# EAGLE design clock (EAGLE 6.4)
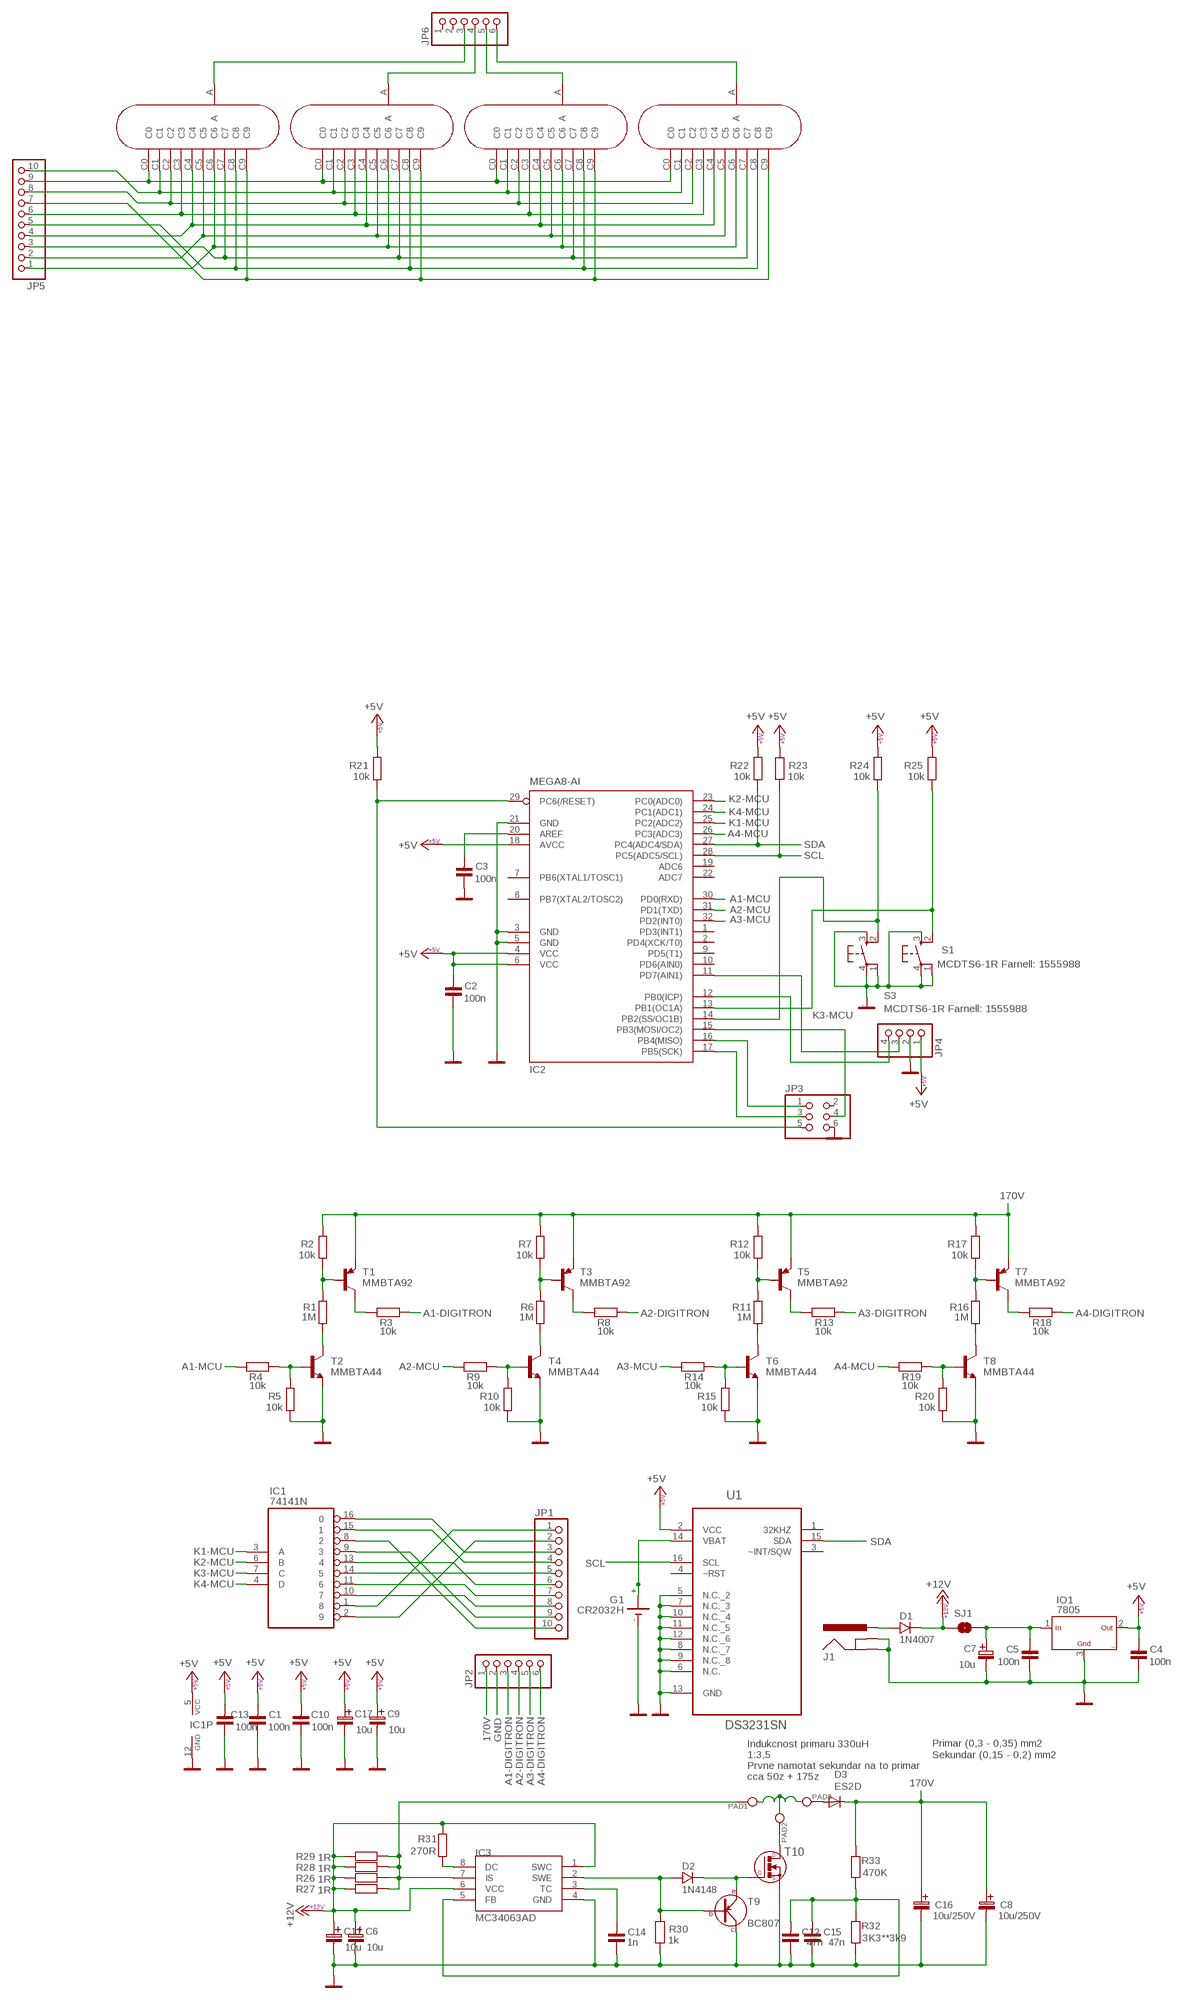
[diagram p0: schematic, sheet 1]

## Parts
C1  100n  C-KERAMIK_SMD_0805  [0805]
C2  100n  C-KERAMIK_SMD_0805  [0805]
C3  100n  C-KERAMIK_SMD_0805  [0805]
C4  100n  C-KERAMIK_SMD_0805  [0805]
C5  100n  C-KERAMIK_SMD_0805  [0805]
C6  10u  10M/16VA  [A]
C7  10u  10M/16VA  [A]
C8  10u/250V  10M/250V  [C_EL_5]
C9  10u  10M/16VA  [A]
C10  100n  C-KERAMIK_SMD_0805  [0805]
C11  10u  10M/16VA  [A]
C12  47n  C-KERAMIK_SMD_0805  [0805]
C13  100n  C-KERAMIK_SMD_0805  [0805]
C14  1n  C-KERAMIK_SMD_0805  [0805]
C15  47n  C-KERAMIK_SMD_0805  [0805]
C16  10u/250V  10M/250V  [C_EL_5]
C17  10u  10M/16VA  [A]
D1  1N4007  1N4007_SM-1  [SM-1]
D2  1N4148  1N4148_SOD80  [SOD-80]
D3  ES2D  [SMB]
E1  Z573M  [Z573M]
E2  Z573M  [Z573M]
E3  Z573M  [Z573M]
E4  Z573M  [Z573M]
G1  CR2032H  [CR2032H]
IC1  74141N  [DIL16]
IC2  MEGA8-AI  [TQFP32-08]
IC3  MC34063AD  [SOIC8]
IO1  7805  78_SMD_SMD  [D2PAK]
J1  SPARKFUN_POWER_JACKSLT  [SPARKFUN_POWER_JACK_SLOT]
JP1  PINHD-1X10  [1X10]
JP2  PINHD-1X6  [1X06]
JP3  PINHD-2X3  [2X03]
JP4  PINHD-1X4  [1X04]
JP5  PINHD-1X10  [1X10]
JP6  PINHD-1X6  [1X06]
PAD1  PAD_1,8  [PAD_1]
PAD2  PAD_1,8  [PAD_1]
PAD3  PAD_1,8  [PAD_1]
R1  1M  R_SMD_0805  [0805]
R2  10k  R_SMD_0805  [0805]
R3  10k  R_SMD_1206  [1206]
R4  10k  R_SMD_0805  [0805]
R5  10k  R_SMD_0805  [0805]
R6  1M  R_SMD_0805  [0805]
R7  10k  R_SMD_0805  [0805]
R8  10k  R_SMD_1206  [1206]
R9  10k  R_SMD_0805  [0805]
R10  10k  R_SMD_0805  [0805]
R11  1M  R_SMD_0805  [0805]
R12  10k  R_SMD_0805  [0805]
R13  10k  R_SMD_1206  [1206]
R14  10k  R_SMD_0805  [0805]
R15  10k  R_SMD_0805  [0805]
R16  1M  R_SMD_0805  [0805]
R17  10k  R_SMD_0805  [0805]
R18  10k  R_SMD_1206  [1206]
R19  10k  R_SMD_0805  [0805]
R20  10k  R_SMD_0805  [0805]
R21  10k  R_SMD_0805  [0805]
R22  10k  R_SMD_0805  [0805]
R23  10k  R_SMD_0805  [0805]
R24  10k  R_SMD_0805  [0805]
R25  10k  R_SMD_0805  [0805]
R26  1R  R_SMD_1206  [1206]
R27  1R  R_SMD_1206  [1206]
R28  1R  R_SMD_1206  [1206]
R29  1R  R_SMD_1206  [1206]
R30  1k  R_SMD_0805  [0805]
R31  270R  R_SMD_0805  [0805]
R32  3K3**3k9  R_SMD_0805  [0805]
R33  470K  R_SMD_0805  [0805]
S1  MCDTS6-1R Farnell: 1555988  31-XX  [B3F-31XX]
S3  MCDTS6-1R Farnell: 1555988  31-XX  [B3F-31XX]
SJ1  SOLDERJUMPERNC  [SJ-NC]
T1  MMBTA92  MMBTA92LT1-PNP-SOT23-BEC  [SOT23-BEC]
T2  MMBTA44  MMBTA42LT1-NPN-SOT23-BEC  [SOT23-BEC]
T3  MMBTA92  MMBTA92LT1-PNP-SOT23-BEC  [SOT23-BEC]
T4  MMBTA44  MMBTA42LT1-NPN-SOT23-BEC  [SOT23-BEC]
T5  MMBTA92  MMBTA92LT1-PNP-SOT23-BEC  [SOT23-BEC]
T6  MMBTA44  MMBTA42LT1-NPN-SOT23-BEC  [SOT23-BEC]
T7  MMBTA92  MMBTA92LT1-PNP-SOT23-BEC  [SOT23-BEC]
T8  MMBTA44  MMBTA42LT1-NPN-SOT23-BEC  [SOT23-BEC]
T9  BC807  [SOT-23]
T10  SMD_NFET  [D2PAK]
U1  DS3231SN  [SOIC127P1032X265-16N]

## Nets
170V: C8.C+(C_EL+) C16.C+(C_EL+) D3.C JP2.1 R2.2 R7.2 R12.2 R17.2 R33.1 T1.E T3.E T5.E T7.E
+5V: C1.2 C2.2 C4.2 C9.+(C_EL+) C10.2 C13.2 C17.+(C_EL+) IC1.5(VCC) IC2.4(VCC) IC2.6(VCC) IC2.18(AVCC) IO1.2(OUT) JP4.1 R21.2 R22.2 R23.2 R24.2 R25.2 U1.2(VCC)
+12V: C6.+(C_EL+) C11.+(C_EL+) D1.K IC3.1(SWC) IC3.6(VCC) R26.1 R27.1 R28.1 R29.1 R31.1 SJ1.1
A1-DIGITRON: JP2.3 R3.1
A1-MCU: IC2.30(PD0(RXD)) R4.2
A2-DIGITRON: JP2.4 R8.1
A2-MCU: IC2.31(PD1(TXD)) R9.2
A3-DIGITRON: JP2.5 R13.1
A3-MCU: IC2.32(PD2(INT0)) R14.2
A4-DIGITRON: JP2.6 R18.1
A4-MCU: IC2.26(PC3(ADC3)) R19.2
GND: C1.1 C2.1 C3.1 C4.1 C5.1 C6.-(C_EL-) C7.-(C_EL-) C8.C-(C_EL-) C9.-(C_EL-) C10.1 C11.-(C_EL-) C12.1 C13.1 C14.1 C15.1 C16.C-(C_EL-) C17.-(C_EL-) G1.- IC1.12(GND) IC2.3(GND) IC2.5(GND) IC2.21(GND) IC3.4(GND) IO1.3(GND) J1.GND@1(GNDBREAK) J1.GND@2(GND) JP2.2 JP3.6 JP4.2 R5.1 R10.1 R15.1 R20.1 R30.1 R32.2 S1.1 S1.3(S) S1.4(P) S3.1 S3.3(S) S3.4(P) T2.E T4.E T6.E T8.E T9.3(C) T10.2(S) U1.5(N.C._2) U1.6(N.C.) U1.7(N.C._3) U1.8(N.C._7) U1.9(N.C._8) U1.10(N.C._4) U1.11(N.C._5) U1.12(N.C._6) U1.13(GND)
K1-MCU: IC1.3(A) IC2.25(PC2(ADC2))
K2-MCU: IC1.6(B) IC2.23(PC0(ADC0))
K3-MCU: IC1.7(C) IC2.15(PB3(MOSI/OC2)) JP3.4
K4-MCU: IC1.4(D) IC2.24(PC1(ADC1))
N$1: R1.2 R2.1 T1.B
N$2: R3.2 T1.C
N$3: R6.2 R7.1 T3.B
N$4: R1.1 T2.C
N$5: R4.1 R5.2 T2.B
N$6: R8.2 T3.C
N$7: R6.1 T4.C
N$8: R9.1 R10.2 T4.B
N$9: R11.2 R12.1 T5.B
N$10: R13.2 T5.C
N$11: R11.1 T6.C
N$12: R14.1 R15.2 T6.B
N$13: R16.2 R17.1 T7.B
N$14: R18.2 T7.C
N$15: R16.1 T8.C
N$16: R19.1 R20.2 T8.B
N$17: IC2.29(PC6(/RESET)) JP3.5 R21.1
N$18: IC2.14(PB2(SS/OC1B)) R24.1 S3.2(S1)
N$19: C3.2 IC2.20(AREF)
N$20: D1.A J1.PWR
N$21: IC2.17(PB5(SCK)) JP3.3
N$24: G1.+ G1.+@1(+) U1.14(VBAT)
N$26: IC2.13(PB1(OC1A)) R25.1 S1.2(S1)
N$27: IC3.7(IS) PAD1.1 R26.2 R27.2 R28.2 R29.2
N$28: C12.2 C15.2 IC3.5(FB) R32.1 R33.2
N$29: PAD2.1 T10.3(D)
N$30: D3.A PAD3.1
N$31: IC1.10 JP1.8
N$32: IC1.9 JP1.9
N$33: IC1.11 JP1.7
N$34: IC1.13 JP1.6
N$35: IC1.8 JP1.10
N$36: IC1.14 JP1.5
N$37: IC1.15 JP1.4
N$38: IC1.16 JP1.3
N$39: IC1.1 JP1.1
N$40: IC1.2 JP1.2
N$41: C14.2 IC3.3(TC)
N$42: D2.A IC3.2(SWE) R30.2 T9.1(B)
N$43: D2.K T9.2(E) T10.1(G)
N$45: IC3.8(DC) R31.2
N$46: IC2.11(PD7(AIN1)) JP4.3
N$47: C5.2 C7.+(C_EL+) IO1.1(IN) SJ1.2
N$53: IC2.12(PB0(ICP)) JP4.4
N$60: E2.A JP6.4
N$61: E1.C0 E2.C0 E3.C0 E4.C0 JP5.9
N$62: E1.C1 E2.C1 E3.C1 E4.C1 JP5.10
N$63: E1.C2 E2.C2 E3.C2 E4.C2 JP5.8
N$64: E1.C3 E2.C3 E3.C3 E4.C3 JP5.6
N$65: E1.C4 E2.C4 E3.C4 E4.C4 JP5.4
N$66: E1.C5 E2.C5 E3.C5 E4.C5 JP5.2
N$67: E1.C6 E2.C6 E3.C6 E4.C6 JP5.1
N$68: E1.C7 E2.C7 E3.C7 E4.C7 JP5.3
N$69: E1.C8 E2.C8 E3.C8 E4.C8 JP5.5
N$70: E1.C9 E2.C9 E3.C9 E4.C9 JP5.7
N$71: E3.A JP6.5
N$72: E4.A JP6.6
N$75: E1.A JP6.3
SCL: IC2.28(PC5(ADC5/SCL)) R23.1 U1.16(SCL)
SDA: IC2.27(PC4(ADC4/SDA)) R22.1 U1.15(SDA)
SDASASDA: IC2.16(PB4(MISO)) JP3.1
Unconnected: IC2.1(PD3(INT1)) IC2.2(PD4(XCK/T0)) IC2.7(PB6(XTAL1/TOSC1)) IC2.8(PB7(XTAL2/TOSC2)) IC2.9(PD5(T1)) IC2.10(PD6(AIN0)) IC2.19(ADC6) IC2.22(ADC7) JP3.2 JP6.1 JP6.2 U1.1(32KHZ) U1.3(~INT/SQW) U1.4(~RST)

## Notes on the sheet
- Indukcnost primaru 330uH
- 1:3,5
- Primar (0,3 - 0,35) mm2
  Sekundar (0,15 - 0,2) mm2
- Prvne namotat sekundar na to primar
- cca 50z + 175z

## Library data of the parts
C1-C5 C10 C12-C15 = #PaJa_22:C-KERAMIK: Kondenzator - keramicky
C6 C7 C9 C11 C17 = #PaJa_C-tantal_SMD:10M/16V
C8 C16 = #PaJa_C-el_2:10M/250V
D1 = #PaJa_22:1N4007: Usmernovaci dioda - 1A, 1000V
D2 = #PaJa_22:1N4148: Univerzalni dioda - 0,15A, 75V
D3 = diode:ES2D: DIODE super fast rectifier, 2 A
E1-E4 = Z573M:Z573M
G1 = battery:CR2032H: LI BATTERY Varta
IC1 = 74xx-eu:74*141: BCD to decimal DECODER/DRIVER
IC2 = atmel:MEGA8: MICROCONTROLLER 8 Kbytes FLASH, 1 kbytes SRAM, 512 bytes EEPROM, USART, 6-channel 10 bit ADC, 2-channel 8 bit ADC Pin compatible with Atmega48, ATMega88, ATMega168 Source: avr.lbr; MPN: ATMEGA8-16AU; OC_FARNELL: 9171371; OC_NEWARK: 73M8863
IC3 = mc34063:MC34063
IO1 = #PaJa_22:78??: Stabilizátor - 1A a 1,5A ?? - napeti => 05, 06, 08, 09, 12, 15, 18, 20, 24 => 1,5A ?? - napeti => 10, 12, 15, 18 => 1A S ?? - napeti => 05, 09, 10, 12, 15, 18, 24 => 2A T ?? - napeti => 05 => 3A
J1 = 74141:SPARKFUN_POWER_JACK: Power Jack This is the standard 5.5mm barrel jack for power. The PTH is the most common, proven, reliable, footprint. All others are experimental. The Slot footprint only works if the mill layer is transmitted to the PCB fab house so be warned. Spark Fun Electronics SKU : PRT-00119. Mating wall wart : TOL-00298 (and others)
JP1 JP5 = pinhead:PINHD-1X10: PIN HEADER
JP2 JP6 = pinhead:PINHD-1X6: PIN HEADER
JP3 = pinhead:PINHD-2X3: PIN HEADER
JP4 = pinhead:PINHD-1X4: PIN HEADER
PAD1-PAD3 = #Jan_01:PAD: Pajeci bod - 1.8 mm prumer
R1 R2 R5-R7 R10-R12 R15-R17 R20-R33 = #PaJa_22:R: Rezistor
R3 R4 R8 R9 R13 R14 R18 R19 = #PaJa_30:R: Rezistor
S1 S3 = switch-omron:31-XX: OMRON SWITCH; MPN: B3F-3100; OC_FARNELL: 959704; OC_NEWARK: 36M3582
SJ1 = SparkFun:SOLDERJUMPER: Solder Jumper Standard SMD solder jumper. Used to automate production. Two varients : Normally Open and Normally Closed are the same, but have different paste layers. NC will have a large amount of paste and should jumper during reflow.
T1 T3 T5 T7 = transistor:*-PNP-: PNP Transistror
T2 T4 T6 T8 = transistor:*-NPN-: NPN Transistror BF959 corrected 2008.03.06
T9 = #PaJa_22:BC807: SMD tranzistor - PNP - ekv. BC327
T10 = #PaJa_22:SMD_NFET
U1 = DS3231:DS3231SN: Extremely Accurate I2C-Integrated RTC/TCXO/Crystal; MPN: DS3231SN#; OC_FARNELL: 1593292; OC_NEWARK: 68K3406; PACKAGE: SOIC-16; SUPPLIER: Maxim

## Board
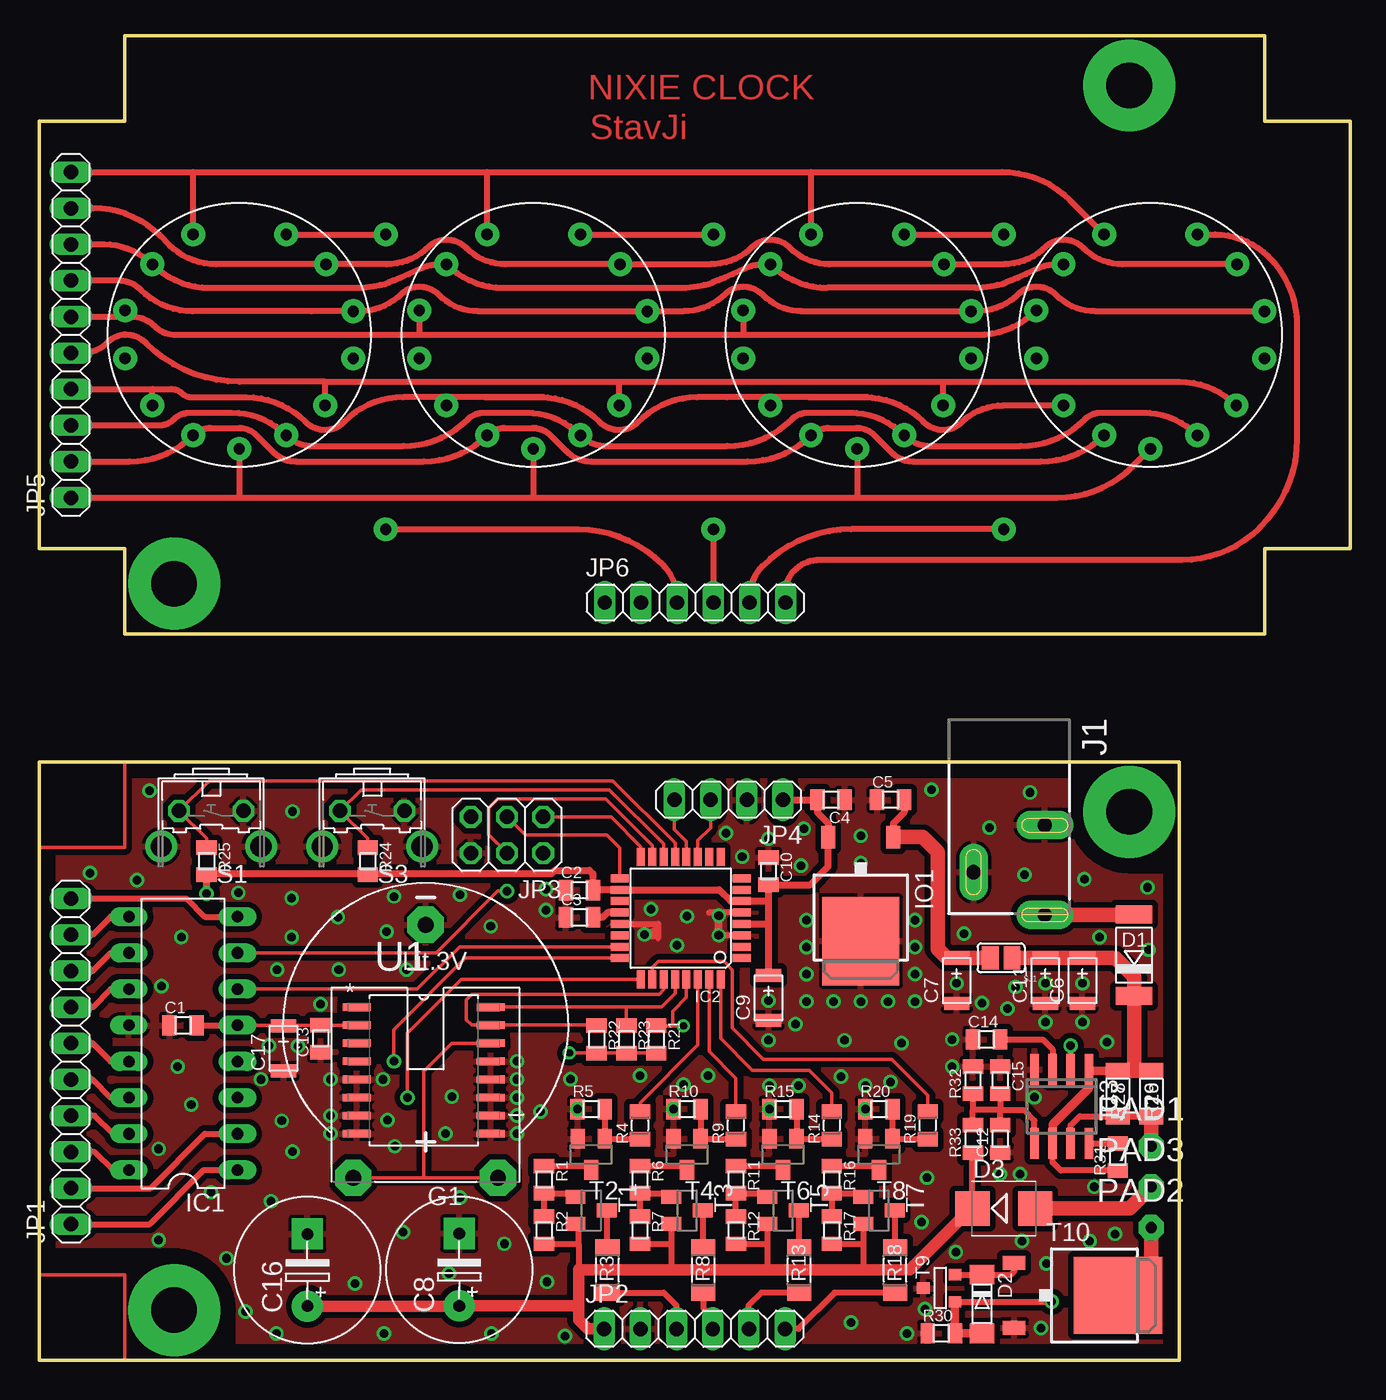
[diagram p1: board, top side]
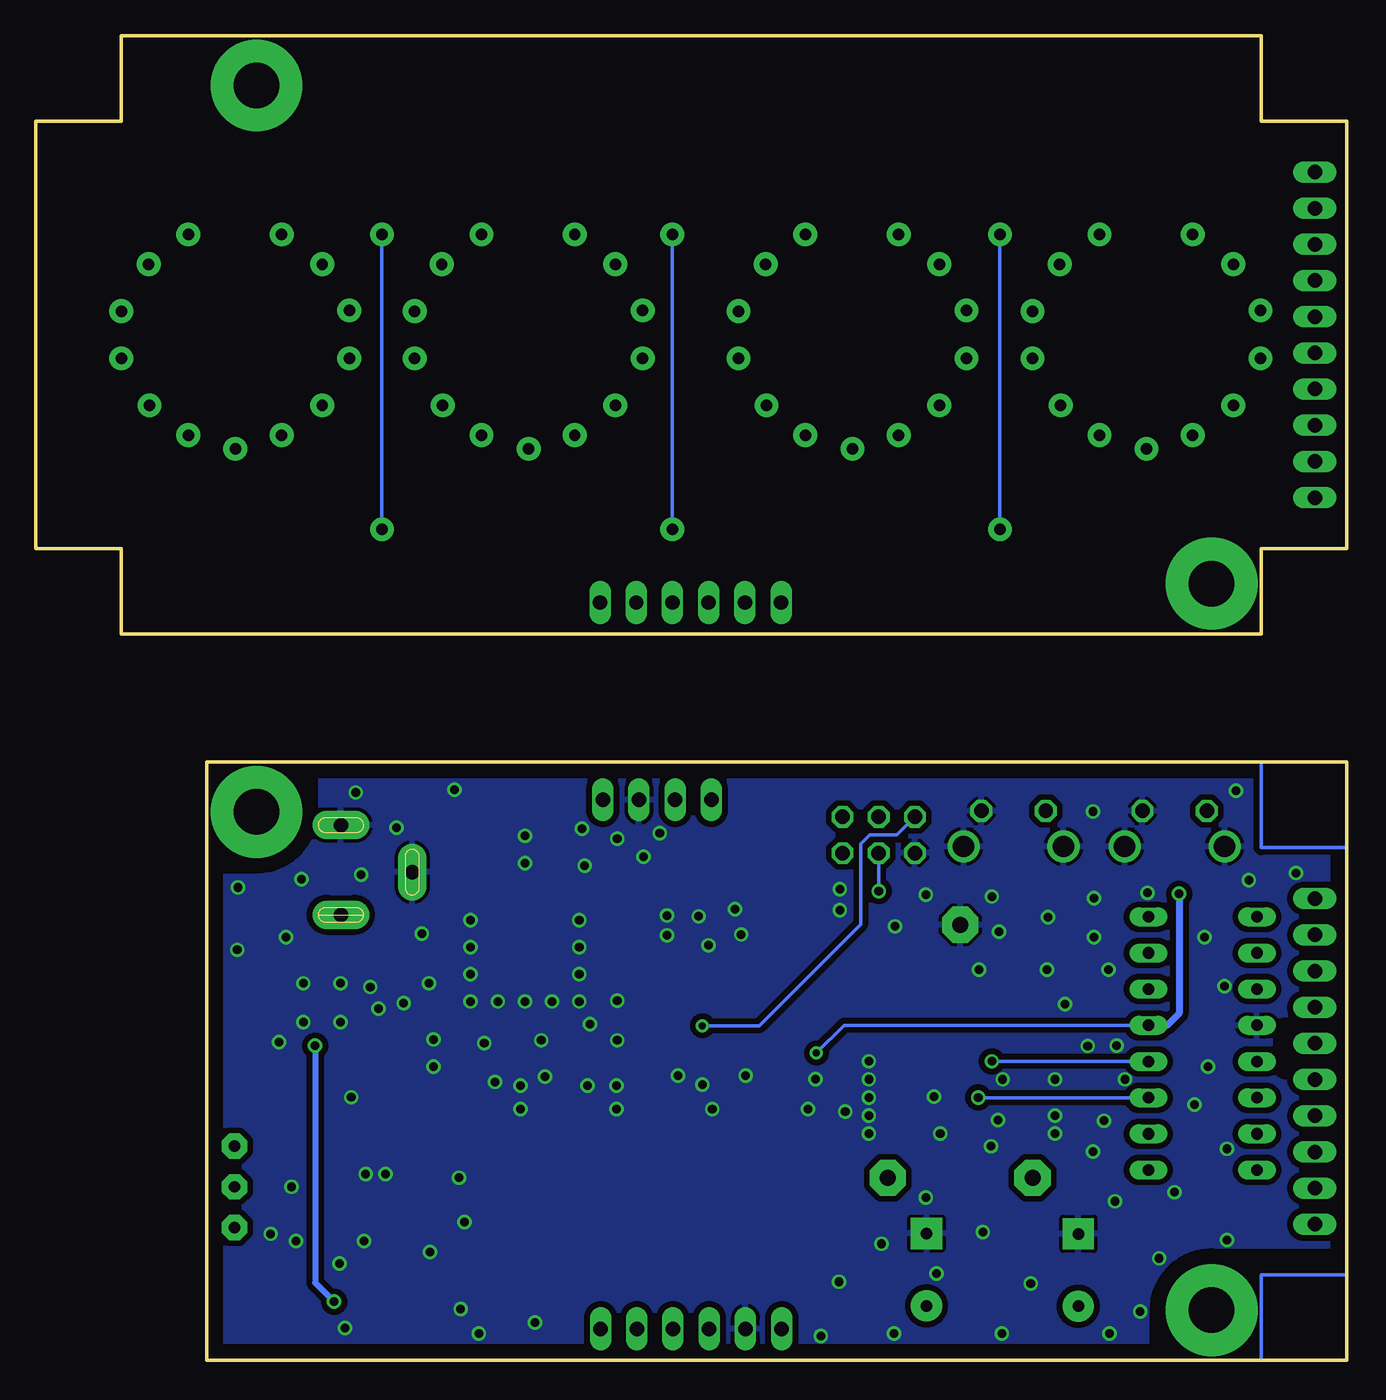
[diagram p2: board, bottom side, seen from below]

Size 92 x 93 mm. Coordinates in mm from the lower left corner, seen from the top.
Outline: 80,33 80,42 0,42 0,0 80,0 80,32.95
Outline: 0,87 0,57 6,57 6,51 86,51 86,57 92,57 92,87 86,87 86,93 6,93 6,87 0,87
Copper layers (1*16): Top 0.035mm / dielectric 1.5mm / Bottom 0.035mm
Design rules "default *": minimum track width 10mil, minimum drill 24mil, track to track 8mil, track to pad 8mil, pad to pad 8mil, via to via 8mil, smd to smd 8mil, copper to edge 40mil, drill to drill 8mil, minimum pad ring 10mil, minimum via ring 8mil, stop-mask expansion 4mil, vias tented up to drill 25mil, thermal gap 10mil
tRestrict: 7 lines
bRestrict: 7 lines

### Footprints (pad centres in the part's own frame; a part is rotated, then mirrored left to right if it is on the bottom)
0805 = smd 1.016 x 1.422: 1 -0.953,0; 2 0.953,0
A = smd 0.914 x 1.778: + 1.587,0; - -1.587,0
C_EL_5 = drill 0.813 pad 2.184: C+ -2.54,0 | drill 0.813 pad 2.184 square: C- 2.54,0
SM-1 = smd 1.27 x 2.54: A 2.857,0; K -2.857,0
SOD-80 = smd 1.397 x 1.702: A 1.905,0; K -2.223,0
SMB = smd 2.4 x 2.4: A 2.2,0; C -2.2,0
Z573M = drill 0.8 pad 1.676: A 3.302,7.048; C0 6.096,4.953; C1 -3.239,7.048; C2 -6.096,4.953; C3 -8.001,1.714; C4 -6.096,-4.953; C5 -3.239,-7.048; C6 0,-8.001; C7 3.302,-7.048; C8 6.032,-4.953; C9 8.001,1.651; NC -8.001,-1.651; PR 8.001,-1.651
CR2032H = drill 1.118 pad 2.54 octagon: + 5.08,10.795; +@1 -5.08,10.795; - 0,-6.985
DIL16 = drill 0.813 long: 1 -8.89,-3.81; 2 -6.35,-3.81; 3 -3.81,-3.81; 4 -1.27,-3.81; 5 1.27,-3.81; 6 3.81,-3.81; 7 6.35,-3.81; 8 8.89,-3.81; 9 8.89,3.81; 10 6.35,3.81; 11 3.81,3.81; 12 1.27,3.81; 13 -1.27,3.81; 14 -3.81,3.81; 15 -6.35,3.81; 16 -8.89,3.81
TQFP32-08 = smd 1.27 x 0.559: 1 -4.293,2.8; 2 -4.293,2; 3 -4.293,1.2; 4 -4.293,0.4; 5 -4.293,-0.4; 6 -4.293,-1.2; 7 -4.293,-2; 8 -4.293,-2.8; 17 4.293,-2.8; 18 4.293,-2; 19 4.293,-1.2; 20 4.293,-0.4; 21 4.293,0.4; 22 4.293,1.2; 23 4.293,2; 24 4.293,2.8 | smd 0.559 x 1.27: 9 -2.8,-4.293; 10 -2,-4.293; 11 -1.2,-4.293; 12 -0.4,-4.293; 13 0.4,-4.293; 14 1.2,-4.293; 15 2,-4.293; 16 2.8,-4.293; 25 2.8,4.293; 26 2,4.293; 27 1.2,4.293; 28 0.4,4.293; 29 -0.4,4.293; 30 -1.2,4.293; 31 -2,4.293; 32 -2.8,4.293
SOIC8 = smd 0.6 x 2.2: 1 -1.905,-2.6; 2 -0.635,-2.6; 3 0.635,-2.6; 4 1.905,-2.6; 5 1.905,2.6; 6 0.635,2.6; 7 -0.635,2.6; 8 -1.905,2.6
D2PAK = smd 1 x 1.6: 1 -2.28,-4.8; 2 2.28,-4.8 | smd 5.4 x 6.2: 3 0,2.5
SPARKFUN_POWER_JACK_SLOT = drill 1 pad 2 long: GND@1 2.58,7.5; GND@2 7.58,10.8; PWR 2.58,13.8
1X10 = drill 1.016 long: 1 -11.43,0; 2 -8.89,0; 3 -6.35,0; 4 -3.81,0; 5 -1.27,0; 6 1.27,0; 7 3.81,0; 8 6.35,0; 9 8.89,0; 10 11.43,0
1X06 = drill 1.016 long: 1 -6.35,0; 2 -3.81,0; 3 -1.27,0; 4 1.27,0; 5 3.81,0; 6 6.35,0
2X03 = drill 1.016 octagon: 1 -2.54,-1.27; 2 -2.54,1.27; 3 0,-1.27; 4 0,1.27; 5 2.54,-1.27; 6 2.54,1.27
1X04 = drill 1.016 long: 1 -3.81,0; 2 -1.27,0; 3 1.27,0; 4 3.81,0
PAD_1 = drill 0.8 pad 1.778 octagon: 1 0,0
1206 = smd 1.143 x 1.702: 1 -1.587,0; 2 1.587,0
B3F-31XX = drill 1.016 octagon: 1 -2.261,-1.245; 2 2.261,-1.245 | drill 1.499 pad 2.159: 3 -3.505,1.245; 4 3.505,1.245
SJ-NC = smd 1.168 x 1.6: 1 -0.762,0; 2 0.762,0
SOT23-BEC = smd 1 x 1.4: B -0.95,-1.1; C 0,1.1; E 0.95,-1.1
SOT-23 = smd 0.787 x 0.889: 1 -0.953,-0.953; 2 0.953,-0.953; 3 0,1.27
SOIC127P1032X265-16N = smd 1.981 x 0.533: 1 -4.699,4.445; 2 -4.699,3.175; 3 -4.699,1.905; 4 -4.699,0.635; 5 -4.699,-0.635; 6 -4.699,-1.905; 7 -4.699,-3.175; 8 -4.699,-4.445; 9 4.699,-4.445; 10 4.699,-3.175; 11 4.699,-1.905; 12 4.699,-0.635; 13 4.699,0.635; 14 4.699,1.905; 15 4.699,3.175; 16 4.699,4.445

### Placement (x,y rotation side)
C1  10.1,23.52 0 top
C2  37.91,33 0 top
C3  37.91,31.1 0 top
C4  55.56,39.35 180 top
C5  59.75,39.35 0 top
C6  73.22,26.65 90 top
C7  64.39,26.65 90 top
C8  29.48,6.36 90 top
C9  51.18,25.45 90 top
C10  51.18,34.34 270 top
C11  70.61,26.65 90 top
C12  67.44,15.54 90 top
C13  19.75,22.59 90 top
C14  66.48,22.53 0 top
C15  67.44,19.67 270 top
C16  18.82,6.33 90 top
C17  17.14,21.89 90 top
D1  76.83,28.43 90 top
D2  66.17,3.79 270 top
D3  67.69,10.65 0 top
E1  14.03,71.99 0 top
E2  34.67,71.99 0 top
E3  57.4,71.99 0 top
E4  77.98,71.99 0 top
G1  27.11,23.59 180 top
IC1  10.1,22.25 90 top
IC2  45.02,31.04 180 top
IC3  71.75,17.83 180 top
IO1  57.66,31.92 180 top
J1  73.15,45.07 180 top
JP1  2.22,20.98 90 top
JP2  46,2.21 0 top
JP3  32.83,36.88 180 top
JP4  48.39,39.35 180 top
JP5  2.22,71.99 90 top
JP6  46.04,53.2 0 top
PAD1  78.04,15.03 0 top
PAD2  78.04,9.32 0 top
PAD3  78.04,12.18 0 top
R1  35.43,12.68 270 top
R2  35.43,9.13 270 top
R3  39.88,6.33 90 top
R4  42.16,16.49 90 top
R5  38.73,17.64 0 top
R6  42.16,12.68 270 top
R7  42.16,9.13 270 top
R8  46.61,6.33 90 top
R9  48.9,16.49 90 top
R10  45.47,17.64 0 top
R11  48.9,12.68 270 top
R12  48.9,9.13 270 top
R13  53.34,6.33 90 top
R14  55.63,16.49 90 top
R15  52.2,17.64 0 top
R16  55.63,12.68 270 top
R17  55.63,9.13 270 top
R18  60.07,6.33 90 top
R19  62.36,16.49 90 top
R20  58.93,17.64 0 top
R21  43.31,22.53 270 top
R22  39.12,22.53 270 top
R23  41.21,22.53 270 top
R24  23.05,35.04 270 top
R25  11.75,35.04 270 top
R26  78.04,18.72 270 top
R27  75.69,18.72 270 top
R28  75.69,18.72 270 top
R29  78.04,18.72 270 top
R30  63.31,1.89 0 top
R31  75.69,14.27 90 top
R32  65.53,19.67 90 top
R33  65.53,15.54 90 top
S1  12.06,37.32 180 top
S3  23.37,37.32 180 top
SJ1  67.5,28.24 180 top
T1  38.73,10.53 270 top
T2  38.73,14.46 180 top
T3  45.47,10.53 270 top
T4  45.47,14.46 180 top
T5  52.2,10.53 270 top
T6  52.2,14.46 180 top
T7  58.93,10.53 270 top
T8  58.93,14.46 180 top
T9  63.31,5.06 90 top
T10  73.22,4.56 270 top
U1  26.99,20.36 0 top

### Tracks (layer width: path | path; a pad name or v marks a point on that pad's centre or on a via)
170V
  Top 0.406: T5.E 51.1,8.18 | 51.1,8.18 51.1,6.38 | 51.1,6.38 51.05,6.34 | T3.E 44.37,8.18 | 44.37,8.18 44.37,6.38 44.32,6.34 | T7.E 57.83,8.18 | 37.85,8.18 37.85,9.57 T1.E | R2.2 37.85,8.18 | 44.32,8.18 44.37,8.18 | R12.2 51.1,8.18 | R17.2 57.83,8.18 | 57.83,8.18 57.83,6.34 | D3.C 65.49,14.55 R33.1 | 37.85,8.18 37.85,6.4 | R7.2 44.32,8.18 | 44.32,8.18 44.32,8.11 | 51.1,6.38 51.1,6.36 51.12,6.34
  Top 0.813: 37.85,6.34 37.85,6.4 | 37.85,6.34 44.32,6.34 51.12,6.34 57.83,6.34 61.09,6.34 65.41,10.65 D3.C | C16.C+ 29.52,3.79 C8.C+ 37.85,3.82 | 37.85,3.82 37.85,6.34 | 37.85,3.82 37.85,2.84 38.48,2.21 JP2.1
+5V  (via drill 0.5, 0.6)
  Top 0.254: R22.2 R23.2 R21.2 R22.2 | R22.2 v37.21,21.57 | IC1.5 17.21,23.52 19.81,23.52 22.28,23.52 U1.2
  Top 0.406: C1.2 IC1.5 | C13.2 19.81,23.54 19.81,23.52 | C17.+ 17.21,23.48 17.21,23.52
  Top 0.508: C9.+ 51.18,30.59 | 51.18,30.59 51.18,32.18 | 51.18,32.18 C10.2 54.1,33.39 55.37,34.66 IO1.2 55.37,36.73 55.37,37.7 54.61,38.47 C4.2 JP4.1 | IC2.4 51.14,30.64 51.18,30.59 | 51.18,32.18 51.12,32.24 IC2.6 48.51,32.24 47.72,33.04 IC2.18 39.05,33.04 C2.2 38.86,34.15 38.61,34.4 36.2,34.4 35.94,34.15 23.05,34.15 | 11.81,34.15 R25.2 | 23.24,34.15 23.3,34.08 R24.2 23.05,34.15 | v11.75,32.75 R25.2 | 23.05,34.15 11.75,34.15 R25.2
  Bottom 0.254: v37.21,21.57 35.27,23.52 IC1.5
  Bottom 0.508: v11.75,32.75 11.75,24.34 12.57,23.52 IC1.5
+12V
  Top 0.406: R31.1 71.69,13.32 71.12,13.89 IC3.6
  Top 0.61: R26.1 77.98,20.3 76.83,20.3 R28.1 75.37,20.3 73.78,20.3 IC3.1 73.66,19.1 71.12,16.56 IC3.6
  Top 1.016: SJ1.1 C11.+ C6.+ 75.5,28.24 76.83,26.91 D1.K 76.83,20.3 | 75.37,20.37 75.37,20.3 77.98,20.3
A1-DIGITRON
  Top 0.406: R3.1 43.81,4.75 44.73,3.83 JP2.3
A1-MCU
  Top 0.254: R4.2 42.16,18.08 46.22,22.14 IC2.30
A2-DIGITRON
  Top 0.406: R8.1 46.61,3.67 47.27,3.01 JP2.4
A2-MCU
  Top 0.254: IC2.31 47.02,21.67 48.9,19.8 R9.2
A3-DIGITRON
  Top 0.406: R13.1 50.67,4.75 49.81,3.88 JP2.5
A3-MCU
  Top 0.254: R14.2 55.63,18.78 54.04,20.37 50.04,20.37 47.82,22.58 IC2.32
A4-DIGITRON
  Top 0.406: R18.1 55.82,4.75 53.28,2.21 JP2.6
A4-MCU
  Top 0.254: R19.2 62.36,18.59 59.82,21.13 50.8,21.13 48.64,23.35 48.64,27.42 48.07,27.99 43.43,27.99 43.02,27.58 IC2.26
GND  (via drill 0.6)
  Top 0.406: IC2.5 46.99,31.44 46.99,31.42 | 47.75,29.84 v47.69,29.83 47.62,29.83 47.62,31.29 47.75,31.29 47.75,29.84 | IC2.3 47.75,29.84 | IC2.21 43.43,30.64 43.43,29.64 | v42.48,29.89 43.18,30.21 43.18,29.77 42.42,29.77 42.42,30.27
  other vias: 57.66,34.91 57.66,25.19 55.75,25.19 59.56,25.19 53.85,29 53.85,27.1 53.85,25.19 61.47,25.19 61.47,29 61.47,27.1 53.85,30.91 61.47,30.91 44.51,17.64 51.24,17.64 57.98,17.64 37.78,17.64 42.93,31.67 67.44,13.07 68.83,13.07 20.45,15.91 20.45,17.18 20.45,19.72 33.53,15.91 33.53,17.18 33.53,18.45 33.53,19.72 33.53,20.99 57.66,36.81 69.85,18.46 64.07,20.62 64.07,22.53 47.69,31.23 35.56,33.07 44.77,29.13 45.47,31.16 56.96,2.65 75.5,8.87 69.15,34.08 62.61,40.05 66.67,37.39 69.53,39.86 28.51,15.91 28.96,18.51 24.96,15.02 24.45,16.86 51.18,36.62 35.56,31.61 49.34,35.35 48.2,37.01 70.29,2.27 60.9,1.89 64.33,7.6 68.96,8.37 70.68,6.78 73.72,8.37 74.04,12.18 61.91,9.7 62.29,12.81 51.18,22.46 53.09,23.61 51.18,25.26 73.22,26.46 70.61,26.46 64.39,26.46 70.61,23.73 73.22,23.73 74.93,22.34 77.85,28.81 74.42,29.7 64.9,29.96 56.52,22.46 60.52,22.27 66.17,25.07 68.52,26.21 67.94,24.69 62.17,3.6 77.79,33.2 73.34,33.77 16.64,1.89 14.48,3.41 22.16,5.38 25.53,9 35.62,5.51 32.64,8.18 36.89,1.7 8.38,8.43 12.06,11.8 13.14,7.16 16.26,11.16 29.53,11.41 17.78,14.65 17.02,16.81 8.38,14.84 10.67,17.95 9.72,20.62 8.57,26.27 9.97,29.7 3.56,34.21 6.86,33.7 7.75,39.99 17.78,38.53 17.72,29.7 17.72,32.43 13.97,32.81 24.38,30.08 20.95,31.1 24.89,32.56 29.53,32.69 31.69,30.46 25.78,27.42 21.02,27.42 16.7,27.42 42.16,19.99 37.27,19.73 35.18,17.45 45.21,19.35 56.26,19.92 57.98,19.29 51.24,19.29 53.28,19.29 46.93,19.99 59.75,19.54 53.47,34.72 53.66,37.32 19.75,25 24.13,19.72 15.56,19.72 18.16,22.07 24.19,1.89 31.75,1.89 28.77,6.08 16.13,22.08
  pour Bottom (isolate 0.406): -1,43 96,43 96,-4 -1,-4
  pour Top (isolate 0.406): -1,43 96,43 96,-4 -1,-4
K1-MCU  (via drill 0.6)
  Top 0.254: v25.84,18.45 25.84,22.96 29.63,26.74 IC2.25
  Bottom 0.254: IC1.3 v25.83,18.44 v25.84,18.45
K2-MCU
  Top 0.254: IC2.23 29.51,29.04 26.53,26.06 IC1.6
K3-MCU  (via drill 0.6)
  Top 0.254: IC2.15 43.02,36.15 39.75,39.42 32.19,39.42 31.56,38.78 31.56,36.88 JP3.4 | IC1.7 27.85,28.6 32.19,32.94 v32.83,32.94
  Bottom 0.254: v32.83,32.94 JP3.4
K4-MCU  (via drill 0.6)
  Top 0.254: v24.89,20.99 24.89,23.21 29.91,28.24 IC2.24
  Bottom 0.254: IC1.4 24.88,20.98 v24.89,20.99
N$1
  Top 0.406: R2.1 R1.2 37.63,11.73 T1.B
N$2
  Top 0.406: T1.C 39.84,7.96 R3.2
N$3
  Top 0.406: R7.1 R6.2 44.37,11.73 T3.B
N$4
  Top 0.406: R1.1 38.73,13.64 T2.C
N$5
  Top 0.406: R5.2 T2.B 42.16,15.56 R4.1
N$6
  Top 0.406: T3.C 46.57,7.96 R8.2
N$7
  Top 0.406: R6.1 45.47,13.64 T4.C
N$8
  Top 0.406: R10.2 T4.B 48.9,15.56 R9.1
N$9
  Top 0.406: R12.1 R11.2 51.1,11.73 T5.B
N$10
  Top 0.406: T5.C 53.3,7.96 R13.2
N$11
  Top 0.406: R11.1 52.2,13.64 T6.C
N$12
  Top 0.406: R15.2 T6.B 55.63,15.56 R14.1
N$13
  Top 0.406: T7.B 57.83,11.73 R16.2 R17.1
N$14
  Top 0.406: T7.C 60.03,7.96 R18.2
N$15
  Top 0.406: R16.1 58.93,13.64 T8.C
N$16
  Top 0.406: R20.2 T8.B 62.34,15.56 R19.1
N$17  (via drill 0.5)
  Top 0.254: v45.21,23.48 44.45,23.48 | 44.45,23.48 R21.1 | IC2.29 45.42,25.47 44.45,24.5 44.45,23.48
  Bottom 0.254: v45.21,23.48 41.21,23.48 34.1,30.59 34.1,36.24 33.47,36.88 31.56,36.88 JP3.5
N$18
  Top 0.254: IC2.14 43.82,36.24 40.01,40.05 22.59,40.05 S3.2 23.05,36.62 R24.1
N$19
  Top 0.508: IC2.20 39.9,31.44 39.56,31.1 C3.2
N$20
  Top 1.016: J1.PWR 77.07,31.27 77.09,31.29 D1.A
N$21
  Top 0.254: JP3.3 34.1,36.88 39.81,36.88 40.73,35.96 IC2.17
N$24
  Top 0.254: G1.+ 26.99,12.8 | 26.99,12.8 G1.+@1 | U1.14 28.96,22.26 26.99,20.29 26.99,12.8
N$26
  Top 0.254: IC2.13 44.62,36.33 40.26,40.69 11.93,40.69 S1.2 11.75,36.62 R25.1
N$27
  Top 0.406: IC3.7 72.39,16.49 73.03,17.13 R27.2 R29.2
  Top 1.016: PAD1.1 R29.2
N$28
  Top 0.406: IC3.5 69.85,16.82 69.09,17.57 67.56,17.57 | C15.2 67.44,17.57 | 67.44,17.57 67.56,17.57 | 67.44,17.57 65.53,17.57 | R32.1 65.53,17.57 | R33.2 65.53,17.57 | C12.2 67.44,17.45 67.56,17.57
N$29
  Top 1.016: 76.14,4.28 T10.3 77.92,4.68 78.04,4.75 PAD2.1
  Top 1.27: 76.58,4.72 T10.3
N$30
  Top 1.016: D3.A 76.52,10.65 PAD3.1
N$31
  Top 0.406: IC1.10 5.02,28.6 3.75,27.33 JP1.8
N$32
  Top 0.406: IC1.9 5.02,31.14 3.75,29.87 JP1.9
N$33
  Top 0.406: IC1.11 5.02,26.06 3.75,24.79 JP1.7
N$34
  Top 0.406: IC1.13 5.02,20.98 3.75,22.25 JP1.6
N$35
  Top 0.406: JP1.10 10.35,32.41 11.62,31.14 IC1.8
N$36
  Top 0.406: IC1.14 5.02,18.44 3.75,19.71 JP1.5
N$37
  Top 0.406: IC1.15 5.14,15.9 3.87,17.17 JP1.4
N$38
  Top 0.406: IC1.16 5.14,13.36 3.87,14.63 JP1.3
N$39
  Top 0.406: JP1.1 7.75,9.55 11.56,13.36 IC1.1
N$40
  Top 0.406: JP1.2 7.81,12.09 11.62,15.9 IC1.2
N$41
  Top 0.406: C14.2 70.42,22.53 71.12,21.83 IC3.3
N$42  (via drill 0.6)
  Top 0.406: IC3.2 v72.39,22.08 | T9.1 v71.06,4.11
  Top 0.61: T9.1 R30.2 D2.A
  Bottom 0.406: v72.39,22.08 72.39,5.45 v71.06,4.11
N$43
  Top 0.406: T9.2 D2.K 68.2,6.02 68.42,6.23 T10.1
N$44  (via drill 3.2 pad 6.45)
  other vias: 76.5,89.5
N$45
  Top 0.406: IC3.8 75.82,15.23 R31.2
N$46
  Top 0.254: IC2.11 46.22,36.49 47.12,37.39 JP4.3
N$47
  Top 0.508: C5.2 60.71,38.47 59.94,37.7 59.94,36.73 IO1.1
  Top 1.016: SJ1.2 C7.+ 63.69,28.24 63.05,28.88 63.05,35.68 62,36.73 IO1.1
N$49
  Top 0.254: 0,36 6,36 6,42
N$52  (via drill 3.2 pad 6.45)
  other vias: 9.46,54.52
N$53
  Top 0.254: IC2.12 45.42,36.41 44.58,37.26 JP4.4
N$54
  Bottom 0.254: 0,36 6,36 6,42
N$55
  Bottom 0.254: 0,6 6,6 6,0
N$56
  Top 0.254: 6,0 6,6 0,6
N$57  (via drill 3.2 pad 6.45)
  other vias: 76.5,38.5
N$58  (via drill 3.2 pad 6.45)
  other vias: 9.46,3.52
N$59
  Top 0.406: 22.46,73.64 arc45 25.42,74.87 arc-45 26.67,75.36 arc-45 28.08,74.77 arc45 30.81,73.64
N$60  (via drill 0.8 pad 1.68)
  Top 0.406: E2.A v47.31,79.04 | v47.31,58.34 JP6.4
  Bottom 0.254: v47.31,79.04 v47.31,58.34
N$61
  Top 0.254: 55.44,76.95 54.1,77.14 53.28,77.64 52.51,78.22 52.01,78.53 51.37,78.66 50.74,78.6 50.23,78.34 49.72,77.9 49.09,77.45 48.39,77.14 47.12,76.95 | 76.01,76.95 75.06,77.07 74.04,77.45 73.28,78.09 72.77,78.47 72.07,78.66 71.37,78.6 70.67,78.28 70.1,77.71 69.41,77.33 68.52,77.01 67.69,76.95
  Top 0.406: JP5.9 3.8,80.88 arc-45 8.48,78.95 9.12,78.31 arc45 12.4,76.95 E1.C0 24.37,76.95 arc45 27.32,78.17 arc-45 28.57,78.66 arc-45 29.99,78.08 arc45 32.71,76.95 E2.C0 47.12,76.95 | 55.44,76.95 E3.C0 67.69,76.95 | E4.C0 76.01,76.95
N$62
  Top 0.406: JP5.10 10.79,83.42 | 10.79,83.42 31.43,83.42 | 31.43,83.42 54.17,83.42 | 54.17,83.42 67.56,83.42 arc-45 72.34,81.44 E4.C1 | E3.C1 54.17,83.42 | E2.C1 31.43,83.42 | E1.C1 10.79,83.42
N$63
  Top 0.254: 65.72,75.3 66.67,75.36 67.56,75.55 68.64,75.99 | 22.4,75.3 24.26,75.55 25.91,76.25 27.18,76.82 E2.C2 | 45.15,75.3 46.67,75.49 48.39,76.12 49.85,76.82 E3.C2
  Top 0.406: JP5.8 4.57,78.34 arc-45 E1.C2 arc45 11.92,75.3 22.4,75.3 | 45.15,75.3 32.56,75.3 arc-45 E2.C2 | 65.72,75.3 55.29,75.3 arc-45 E3.C2 | E4.C2 71.46,76.95 arc8 70.85,76.88 arc18 70.04,76.63 69.22,76.25 68.64,75.99
N$64
  Top 0.406: 26.67,71.99 9.59,71.99 arc-45 8.07,72.62 arc45 6.53,73.26 6.03,73.26 | E2.C3 26.67,71.99 | 26.67,71.99 49.4,71.99 | 49.4,71.99 65.84,71.99 arc45 E4.C3 | E3.C3 49.4,71.99 | JP5.6 6.03,73.26 | E1.C3 6.03,73.26
N$65
  Top 0.254: 67.63,67.04 66.55,66.91 65.53,66.47 64.77,65.9 64.2,65.45 63.31,65.33 62.48,65.58 61.59,66.28 60.77,66.79 60.07,67.23 58.67,67.61 57.34,67.61 | 18.67,65.9 19.49,65.39 20.32,65.33 20.95,65.52 21.02,65.52 21.34,65.83 | 35.43,67.61 35.88,67.55 36.96,67.36 38.04,66.85 38.92,66.28 39.62,65.58 40.64,65.33 41.34,65.39 41.97,65.9 41.98,65.9 41.98,65.84
  Top 0.406: E4.C4 67.63,67.04 | 18.67,65.9 arc45 14.53,67.61 10.66,67.61 arc-45 10.03,67.87 arc45 9.28,68.18 7.94,68.18 | JP5.4 7.94,68.18 | E1.C4 7.94,68.18 | 35.43,67.61 28.57,67.61 | 28.57,67.61 25.53,67.61 arc45 21.4,65.9 21.34,65.83 | E2.C4 28.57,67.61 | 41.98,65.84 arc-45 46.17,67.61 51.31,67.61 | 57.34,67.61 51.31,67.61 | E3.C4 51.31,67.61
N$66
  Top 0.254: E3.C5 54.67,65.33 55.44,65.45 57.41,65.45
  Top 0.406: JP5.2 6.35,63.1 arc45 E1.C5 arc-45 12.02,65.45 14.07,65.45 arc-45 15.2,64.98 16.41,63.77 arc45 18.03,63.1 26.99,63.1 arc45 E2.C5 arc-45 32.66,65.45 34.62,65.45 arc-45 35.9,64.93 36.99,63.83 arc45 38.75,63.1 49.72,63.1 arc45 E3.C5 | 57.41,65.45 arc-45 58.59,64.96 59.82,63.74 arc45 61.35,63.1 70.29,63.1 arc45 E4.C5
N$67
  Top 0.406: JP5.1 14.03,60.56 | 14.03,60.56 34.67,60.56 | 34.67,60.56 57.4,60.56 | 57.4,60.56 71.42,60.56 arc45 76.76,62.78 E4.C6 | E3.C6 57.4,60.56 | E2.C6 34.67,60.56 | E1.C6 14.03,60.56
N$68
  Top 0.254: 34.42,66.53 35.69,66.34 36.7,65.9 37.34,65.45 E2.C7 | 48.3,64.18 50.04,64.37 51.88,65.26 53.15,66.34 53.91,66.53 57.02,66.53 58.36,66.34 59.56,65.83 60.13,65.45 E3.C7 | 68.89,64.18 69.6,64.25 71.25,64.63 72.64,65.45 73.72,66.34 74.68,66.53 77.09,66.53 78.42,66.47 79.38,66.15 80.07,65.9 80.58,65.58 E4.C7
  Top 0.406: JP5.3 8.44,65.64 arc45 9.43,66.05 arc-45 10.58,66.53 13.5,66.53 arc-45 E1.C7 arc45 19.18,64.18 25.55,64.18 arc45 30.07,66.05 arc-45 31.22,66.53 34.42,66.53 | 37.85,65.07 E2.C7 arc45 39.81,64.18 48.3,64.18 | 60.38,65.27 E3.C7 arc45 62.55,64.18 68.89,64.18 | 81,65.22 E4.C7
N$69
  Top 0.254: 4.83,71.49 5.52,71.93 6.1,71.99 6.54,71.93 6.99,71.8 7.49,71.42
  Top 0.406: 20.07,68.69 14.07,68.69 arc-45 7.51,71.41 7.49,71.42 | 20.07,68.69 40.7,68.69 | 40.7,68.69 63.44,68.69 | 63.44,68.69 80.03,68.69 arc-45 E4.C8 | E3.C8 63.44,68.69 | E2.C8 40.7,68.69 | E1.C8 20.07,68.69 | JP5.5 2.99,70.72 arc45 4.82,71.48 4.83,71.49
N$70
  Top 0.254: 22.48,73.64 23.81,73.83 24.64,74.28 25.46,74.92 25.97,75.23 26.67,75.36 27.24,75.3 27.94,74.92 28.57,74.34 29.78,73.77 30.8,73.64 | 45.21,73.64 46.55,73.83 47.69,74.41 48.45,75.11 49.15,75.36 49.85,75.3 50.42,75.11 51.05,74.53 51.69,74.09 52.51,73.77 53.47,73.64 | 65.79,73.64 66.61,73.71 67.69,74.09 68.58,74.72 69.15,75.17 69.85,75.36 70.61,75.3 71.18,74.92 72.26,74.09 73.09,73.77 73.91,73.64 74.17,73.64
  Top 0.406: E1.C9 10.75,73.64 arc-45 7.14,75.14 arc45 5.54,75.8 JP5.7 | E1.C9 19.11,73.64 | 30.8,73.64 E2.C9 45.21,73.64 | E1.C9 22.48,73.64 | 53.47,73.64 E3.C9 65.79,73.64 | 74.17,73.64 E4.C9
N$71  (via drill 0.8 pad 1.68)
  Top 0.406: E3.A v67.69,79.04 | v67.69,58.34 56.97,58.34 arc45 50.77,55.77 50.75,55.75 arc45 49.85,53.58 JP6.5
  Bottom 0.254: v67.69,79.04 v67.69,58.34
N$72
  Top 0.406: E4.A 82.53,79.04 arc-45 86.25,77.5 86.26,77.49 arc-45 88.27,72.65 88.27,64.7 arc-45 85.7,58.5 85.63,58.44 arc-45 80.19,56.18 54.76,56.18 arc45 52.99,55.45 52.98,55.44 arc45 52.39,54.01 JP6.6
N$73
  Top 0.406: 20.07,66.98 20.07,68.69
N$74
  Top 0.406: 26.67,73.64 26.67,71.99
N$75  (via drill 0.8 pad 1.68)
  Top 0.406: E1.A v24.32,79.04 | v24.32,58.34 37.85,58.34 arc-45 43.7,55.92 43.71,55.9 arc-45 44.77,53.36 JP6.3
  Bottom 0.254: v24.32,79.04 v24.32,58.34
N$76
  Top 0.406: 47.1,76.95 arc45 50.05,78.17 arc-45 51.31,78.66 arc-45 52.72,78.08 arc45 55.45,76.95
N$77
  Top 0.406: 45.2,73.64 arc45 48.15,74.87 arc-45 49.4,75.36 arc-45 50.81,74.77 arc45 53.54,73.64
N$78
  Top 0.406: 65.77,73.64 arc45 68.72,74.87 arc-45 69.97,75.36 arc-45 71.39,74.77 arc45 74.11,73.64
N$79
  Top 0.406: 67.68,76.95 arc45 70.63,78.17 arc-45 71.88,78.66 arc-45 73.29,78.08 arc45 76.02,76.95
N$83  (via drill 0.8 pad 3.17)
  other vias: 9.46,54.53
N$86
  Top 0.254: 4.89,71.55 5.4,71.87 6.1,71.99 6.67,71.93 7.37,71.55
N$87
  Top 0.406: 7.51,71.41 arc45 6.09,71.99 arc45 4.84,71.5
N$88
  Top 0.406: 18.66,65.91 arc45 20.07,65.33 arc45 21.32,65.82
N$89
  Top 0.406: 20.07,67.04 20.07,68.69
N$90
  Top 0.406: 40.7,66.98 40.7,68.69
N$92
  Top 0.406: 39.29,65.91 arc45 40.71,65.33 arc45 41.96,65.82
N$93
  Top 0.406: 40.7,67.04 40.7,68.69
N$94
  Top 0.406: 63.44,66.98 63.44,68.69
N$96
  Top 0.406: 67.64,67.04 arc45 64.69,65.82 arc-45 63.44,65.33 arc-45 62.03,65.91
N$97
  Top 0.406: 63.44,67.04 63.44,68.69
N$101
  Top 0.254: 22.42,75.3 23.37,75.36 24.26,75.55 25.34,75.99
  Top 0.406: 28.57,76.95 28.16,76.95 arc8 27.54,76.88 arc18 26.73,76.63 25.91,76.25 25.34,75.99
N$103
  Top 0.406: 22.4,75.3 arc12 23.46,75.41 23.91,75.49 arc17 24.51,75.64 24.93,75.83 arc-8 25.37,76
N$104  (via drill 0.8 pad 3.17)
  other vias: 76.5,89.5
N$105
  Top 0.406: 65.7,75.3 arc12 66.76,75.41 67.22,75.49 arc17 67.82,75.64 68.24,75.83 arc-8 68.68,76
N$108
  Top 0.254: 45.15,75.3 46.1,75.36 46.99,75.55 48.07,75.99
  Top 0.406: 51.31,76.95 50.89,76.95 arc8 50.27,76.88 arc18 49.46,76.63 48.64,76.25 48.07,75.99
N$109
  Top 0.406: 45.13,75.3 arc12 46.19,75.41 46.64,75.49 arc17 47.24,75.64 47.67,75.83 arc-8 48.1,76
N$110
  Top 0.406: 39.31,65.9 arc45 35.17,67.61 31.29,67.61
N$111
  Top 0.406: 31.43,64.94 arc-45 32.66,65.45 34.71,65.45 arc-45 35.84,64.98 37.05,63.77
N$112
  Top 0.406: 31.22,66.53 34.14,66.53 arc-45 37.97,64.94
N$113
  Top 0.254: 61.66,66.28 60.77,66.85 59.69,67.36 58.61,67.55 58.17,67.61
  Top 0.406: 58.17,67.61 51.31,67.61 | 51.31,67.61 48.27,67.61 | 51.31,67.04 51.31,67.61
N$114
  Top 0.254: 57.36,65.45 57.91,65.39 58.63,64.93
  Top 0.406: 49.72,63.1 arc45 54.17,64.94 arc-45 55.39,65.45 57.36,65.45 | 58.63,64.93 59.72,63.83
N$115
  Top 0.254: 57.15,66.53 58.42,66.34 59.44,65.9 60.07,65.45 60.71,64.94
  Top 0.406: 60.58,65.07 60.71,64.94 arc45 62.55,64.18 | 48.28,64.18 arc45 52.8,66.05 arc-45 53.95,66.53 57.15,66.53
N$116
  Top 0.406: 62.04,65.9 arc45 57.9,67.61 54.03,67.61
N$117
  Top 0.406: 54.17,64.94 arc-45 55.39,65.45 57.44,65.45 arc-45 58.57,64.98 59.78,63.77
N$118
  Top 0.406: 53.95,66.53 56.87,66.53 arc-45 60.71,64.94
N$120
  Top 0.406: 70.29,63.1 arc45 74.74,64.94
N$121
  Top 0.254: 77.72,66.53 78.99,66.34 80.01,65.9 80.64,65.45 81.28,64.94
  Top 0.406: 81.15,65.07 81.28,64.94 | 68.85,64.18 arc45 73.37,66.05 arc-45 74.53,66.53 77.72,66.53
N$124
  Top 0.406: 74.53,66.53 77.45,66.53 arc-45 81.28,64.94
SCL
  Top 0.254: U1.16 41.15,24.8 | IC2.28 44.64,26.47 44.64,25.77 43.67,24.8 41.15,24.8 | R23.1 41.21,24.74 41.15,24.8
SDA
  Top 0.254: R22.1 39.06,23.53 U1.15 30.35,23.53 29.97,23.91 29.97,25.31 30.37,25.7 43.5,25.7 43.82,26.03 IC2.27
SDASASDA
  Top 0.254: IC2.16 42.23,36.05 40.13,38.15 JP3.1

### Text on the board
Top: NIXIE CLOCK | StavJi